# EasyEDA Pro project CH32V203_Wireless_Charge_V1.1.eprj, board CH32V203_Wireless_Charge
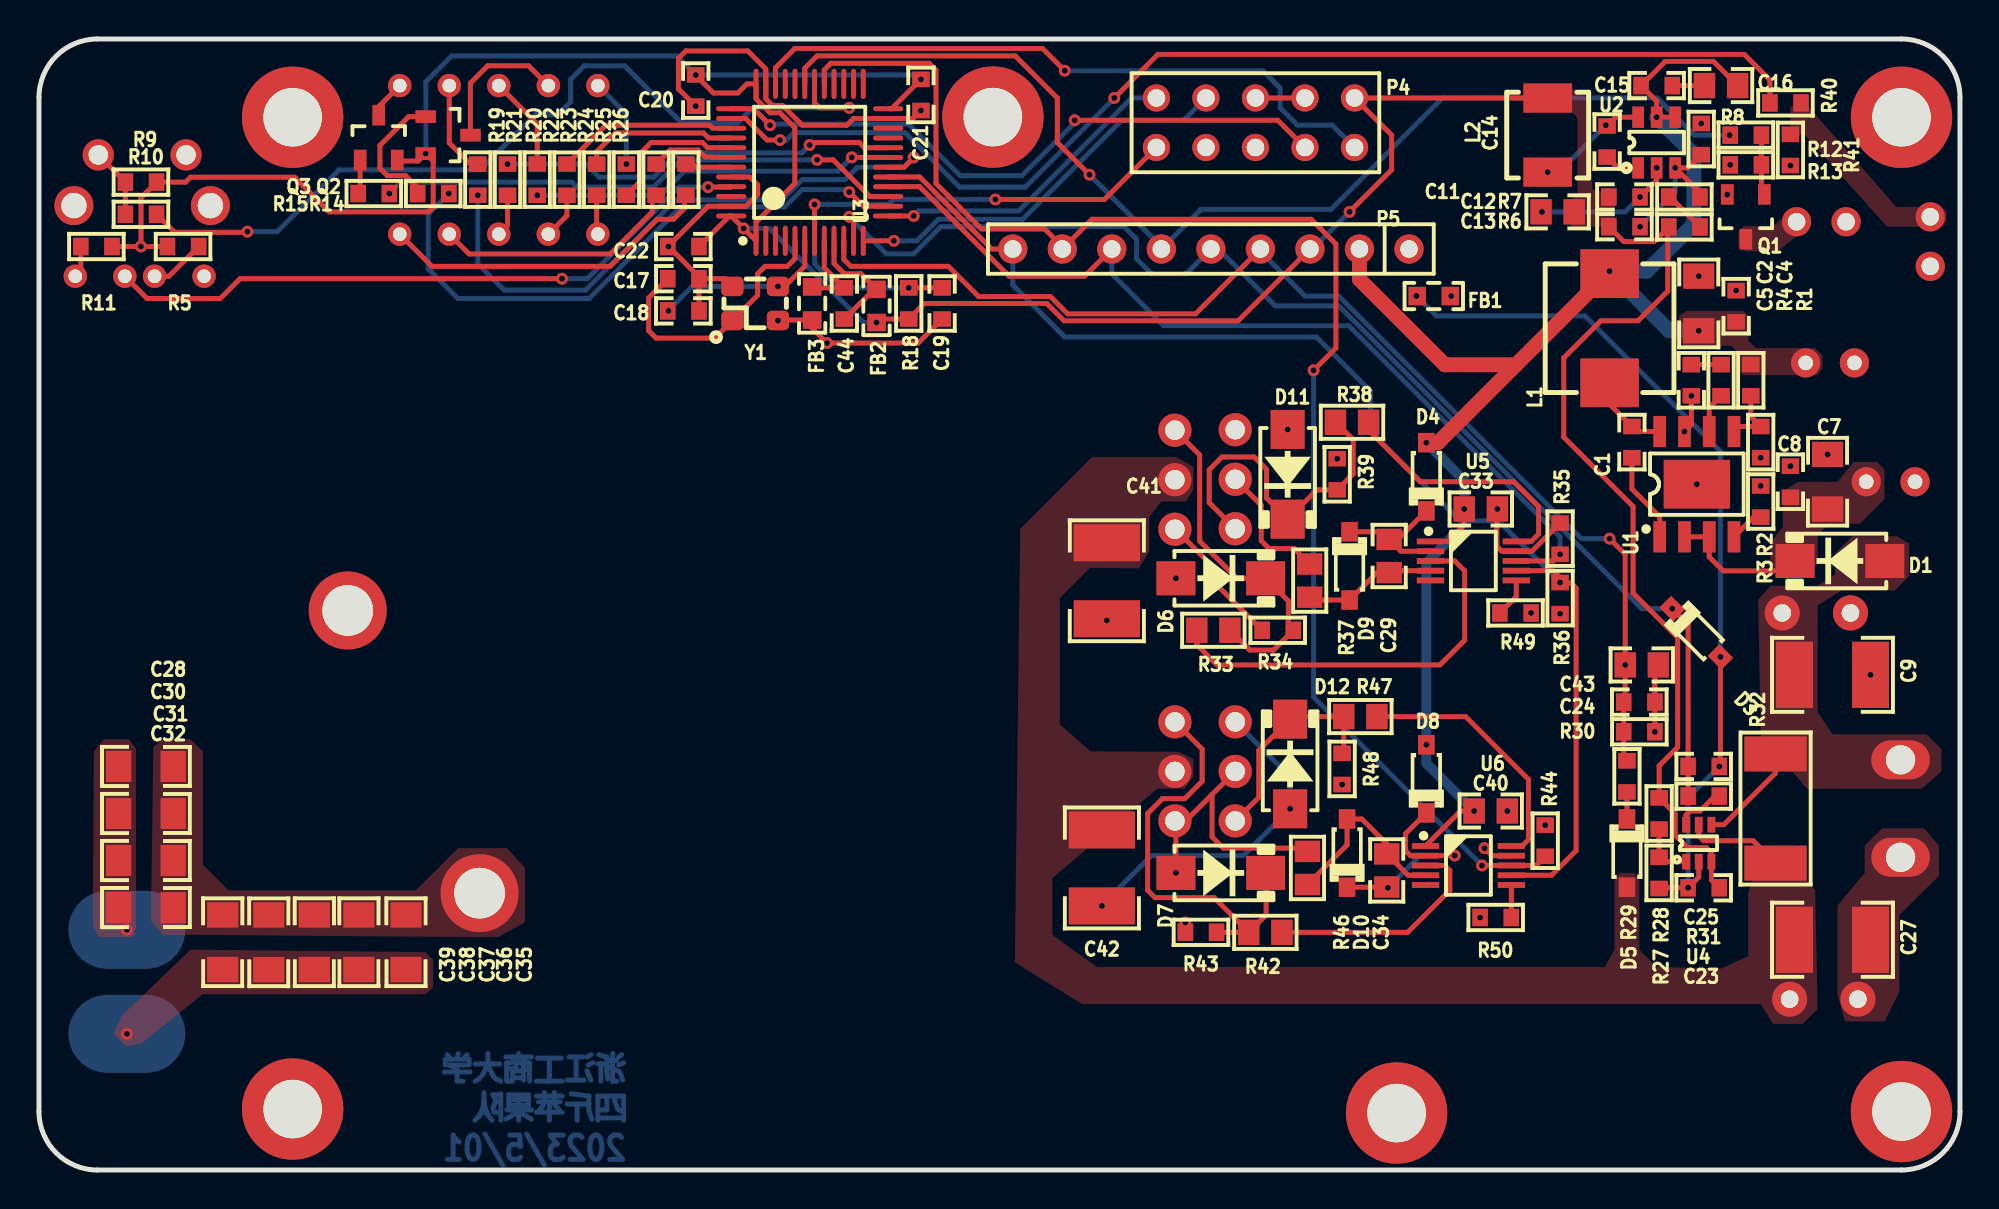
[diagram p1: board, top side]
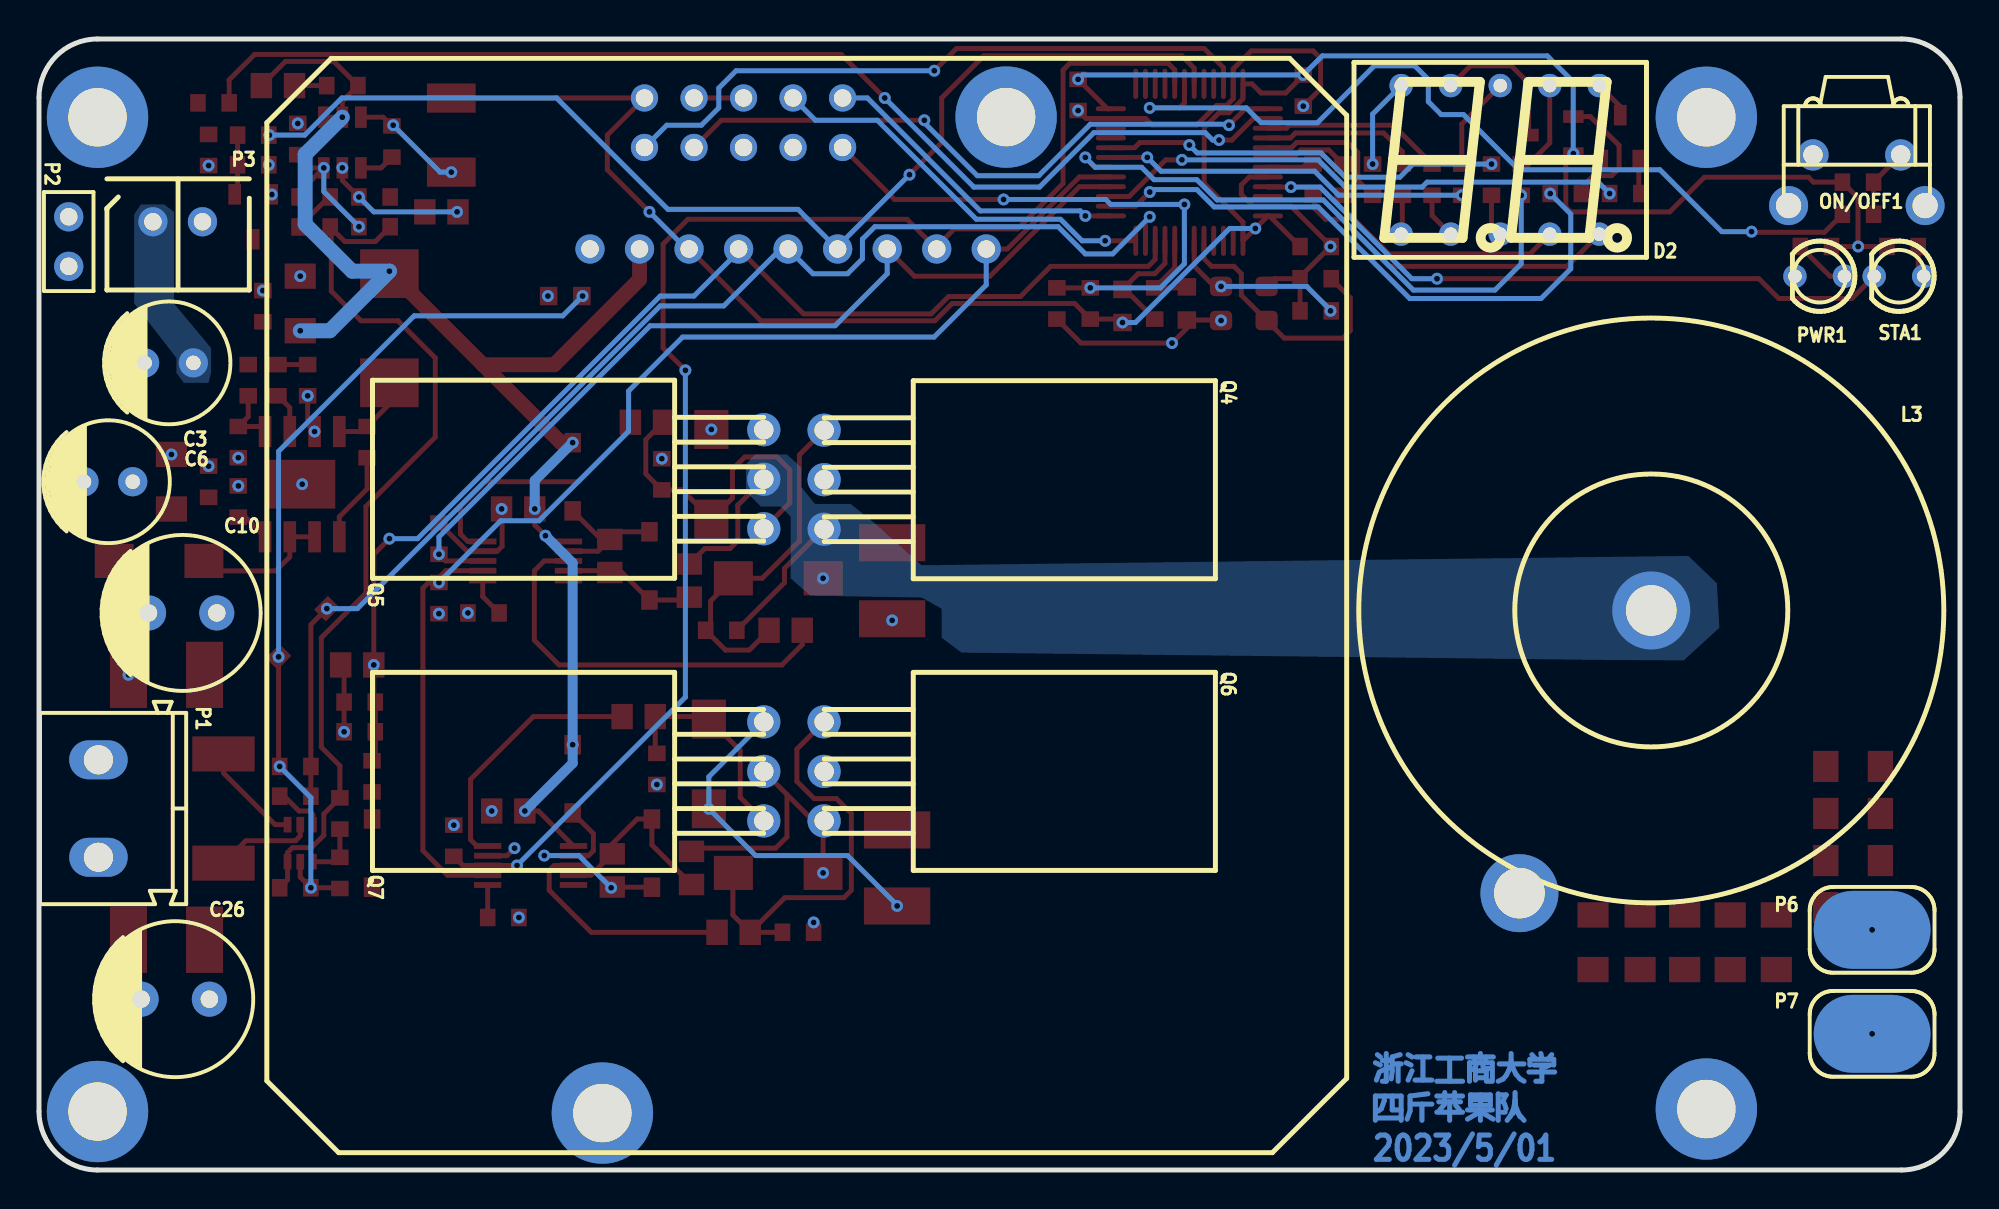
[diagram p2: board, bottom side, seen from below]

Outline 98.51 x 58.02 mm; copper layers: Top Layer, Bottom Layer. Coordinates in mm from the lower left corner of the outline.
Outline path: 0,55.02 0,3 arc(0.88,0.88) 3,0 95.51,0 arc(97.63,0.88) 98.51,3 98.51,55.02 arc(97.63,57.14) 95.51,58.02 3,58.02 arc(0.88,57.14) 0,55.02
Stack: Top Layer 0.0356mm / Dielectric 1 0.32mm FR-4 er 4.8 / Bottom Layer 0.0356mm

## Design rules (mm)
template: 用户自定义配置
spacing copperThickness1oz (default): track to track 0.102, other pairs 0.152 to 0.3
spacing copperThickness2oz: track to track 0.203, other pairs 0.152 to 0.3
track width copperThickness1oz (default): min 0.127, default 0.254, max 2.54
track width copperThickness2oz: min 0.203, default 0.254, max 2.54
differential pair differentialPair (default): width min 0.127, default 0.254, max 2.54; gap min 0.152, default 0.152
via viaSize (default): diameter min 0.5, default 0.61, max 10; hole min 0.3, default 0.305, max 6.299

## Placement (name value [footprint] x y rotation side)
C1  100nF  [CAPC1608[0603]S-N]  81.68 37.34 90 top
C2  47uF  [CAPC3216[1206]S]  85.11 44.45 270 top
C3  220uF  [Cap-S-D 2.5-6.3X8]  91.84 41.4 0 bottom
C4  100nF  [CAPC1608[0603]S-N]  87.03 44.31 270 top
C5  4.7nF  [CAPC1608[0603]S-N]  84.73 40.51 90 top
C6  100uF  [Cap-S-D 2.5-6.3X8]  94.95 35.31 0 bottom
C7  4.7uF  [CAPC3216[1206]S]  91.72 35.31 270 top
C8  100nF  [CAPC1608[0603]S-N]  89.81 35.31 270 top
C9  47uF  [CAPC4532[1812]S]  91.97 25.4 0 top
C10  470uF  [Cap-S-D 3.5-8x14]  91.14 28.58 0 bottom
C11  22uF  [CAPC2012[0805]S-N]  77.87 49.15 180 top
C12  100nF  [CAPC1608[0603]S-N]  81.3 49.91 0 top
C13  220pF  [CAPC1608[0603]S-N]  81.3 48.39 0 top
C14  100nF  [CAPC1608[0603]S-N]  80.41 52.76 90 top
C15  100nF  [CAPC1608[0603]S-N]  82.95 55.63 0 top
C16  22uF  [CAPC2012[0805]S-N]  86.26 55.63 180 top
C17  18pF  [CAPC1608[0603]S-N]  33.04 45.72 0 top
C18  18pF  [CAPC1608[0603]S-N]  33.04 44.07 0 top
C19  100nF  [CAPC1608[0603]S-N]  46.31 44.45 90 top
C20  100nF  [CAPC1608[0603]S-N]  33.68 55.37 90 top
C21  100nF  [CAPC1608[0603]S-N]  45.22 55.15 90 top
C22  100nF  [CAPC1608[0603]S-N]  33.04 47.37 0 top
C23  100nF  [CAPC1608[0603]S-N]  85.37 14.48 0 top
C24  100nF  [CAPC1608[0603]S-N]  82.06 24 0 top
C25  1uF  [CAPC1608[0603]S-N]  85.37 20.7 0 top
C26  470uF  [Cap-S-D 3.5-8x14]  91.52 8.76 0 bottom
C27  47uF  [CAPC4532[1812]S]  91.97 11.81 0 top
C28  10nF  [CAPC3216[1206]S]  5.48 20.7 180 top
C29  10uF  [CAPC2012[0805]S-N]  69.24 31.5 270 top
C30  10nF  [CAPC3216[1206]S]  5.48 18.29 180 top
C31  10nF  [CAPC3216[1206]S]  5.48 15.88 180 top
C32  10nF  [CAPC3216[1206]S]  5.48 13.46 180 top
C33  22uF  [CAPC2012[0805]S-N]  73.94 33.91 0 top
C34  10uF  [CAPC2012[0805]S-N]  69.11 15.37 270 top
C35  1nF  [CAPC3216[1206]S]  18.82 11.68 90 top
C36  1nF  [CAPC3216[1206]S]  16.41 11.68 90 top
C37  100nF  [CAPC3216[1206]S]  14.12 11.68 90 top
C38  100nF  [CAPC3216[1206]S]  11.78 11.68 90 top
C39  100nF  [CAPC3216[1206]S]  9.42 11.68 90 top
C40  22uF  [CAPC2012[0805]S-N]  74.44 18.42 180 top
C41  47uF  [CAPC4532[1812]S]  54.76 30.23 90 top
C42  47uF  [CAPC4532[1812]S]  54.51 15.49 90 top
C43  10uF  [CAPC2012[0805]S-N]  82.19 25.91 0 top
C44  100nF  [CAPC1608[0603]S-N]  41.3 44.45 90 top
D1  SS54  [SMA-L[DO-214AC]]  92.35 31.24 180 top
D2  2821BS  [2821AS/BS]  23.58 51.82 180 bottom
D3  SMF3.3A  [SOD-123-L]  84.99 27.56 135 top
D4  1N4148  [SOD-123-L]  71.14 35.56 270 top
D5  1N4148  [SOD-123-L]  81.43 16.26 90 top
D6  SS54  [SMA-L[DO-214AC]]  60.6 30.35 0 top
D7  SS54  [SMA-L[DO-214AC]]  60.6 15.24 0 top
D8  1N4148  [SOD-123-L]  71.14 20.07 270 top
D9  SMF12A  [SOD-123-L]  67.21 30.99 90 top
D10  SMF12A  [SOD-123-L]  67.08 16.26 270 top
D11  SS54  [SMA-L[DO-214AC]]  64.03 35.69 270 top
D12  SS54  [SMA-L[DO-214AC]]  64.16 20.83 90 top
FB1  0R  [INDC1608[0603]S]  71.52 44.83 180 top
FB2  0R  [INDC1608[0603]S]  42.95 44.32 90 top
FB3  0R  [INDC1608[0603]S]  39.65 44.45 270 top
L1  4.7uH  [0630 TPC 7*7*3]  80.54 43.18 90 top
L2  3.3uH  [0402 TPC 4*4*2]  77.37 53.09 270 top
L3  3.722uH  [T94/106-LAY]  15.83 28.7 295 bottom
M1  MountHole  [m3-mounthole-plated]  95.51 54 180 bottom
M2  MountHole  [m3-mounthole-plated]  13.01 54 180 bottom
M3  MountHole  [m3-mounthole-plated]  95.51 3 180 bottom
M4  MountHole  [m3-mounthole-plated]  13.01 3.13 180 bottom
M5  MountHole  [m3-mounthole-plated]  48.92 54.01 0 top
M6  MountHole  [m3-mounthole-plated]  69.62 2.92 0 top
ON/OFF1  Button  [KEY-2-DIP-6*6-S]  5.29 52.07 180 bottom
P1  KF/WJ/DG 30x connecter  [KF/WJ/DG 301-2p-5.0mm]  95.46 18.54 270 bottom
P2  Header-D-M 1x2P  [HDR1X2-M]  96.98 48.89 270 bottom
P3  XH2.54-2P  [XH2.54-2P-DV]  92.67 48.64 180 bottom
P4  SWD  [HDR2X5-M]  67.46 54.99 180 top
P5  Header-D-M 1x9P  [HDR1X9-M]  70.25 47.24 180 top
P6  WirePad  [WirePad-4x6]  4.51 12.32 180 bottom
P7  WirePad  [WirePad-4x6]  4.51 6.98 180 bottom
PWR1  LED 3R  [LED-R3-H5-SINGLE-R]  7.19 45.85 0 bottom
Q1  AO3400  [SOT-23]  87.53 48.89 270 top
Q2  S8550  [SOT-23]  20.98 53.09 0 top
Q3  S8550  [SOT-23]  17.42 52.96 90 top
Q4  HYG180N10LS1P  [TO-220-LAY]  58.25 37.95 270 bottom
Q5  HYG180N10LS1P  [TO-220-LAY]  61.34 32.89 90 bottom
Q6  HYG180N10LS1P  [TO-220-LAY]  58.25 22.99 270 bottom
Q7  HYG180N10LS1P  [TO-220-LAY]  61.34 17.91 90 bottom
R1  140K  [RESC1608[0603]S-N]  87.78 40.51 270 top
R2  10K  [RESC1608[0603]S-N]  88.29 37.34 270 top
R3  200K  [RESC1608[0603]S-N]  88.29 34.29 270 top
R4  20K  [RESC1608[0603]S-N]  86.26 40.51 270 top
R5  2.7K  [RESC1608[0603]S-N]  7.39 47.37 0 top
R6  30K  [RESC1608[0603]S-N]  84.38 48.38 0 top
R7  15K  [RESC1608[0603]S-N]  84.38 49.91 180 top
R8  10K  [RESC1608[0603]S-N]  85.24 52.88 90 top
R9  10K  [RESC1608[0603]S-N]  5.23 50.67 180 top
R10  100R  [RESC1608[0603]S-N]  5.23 49.02 180 top
R11  2.7K  [RESC1608[0603]S-N]  2.94 47.37 180 top
R12  100R  [RESC1608[0603]S-N]  87.53 53.09 0 top
R13  10K  [RESC1608[0603]S-N]  87.53 51.56 180 top
R14  100R  [RESC1608[0603]S-N]  20.22 50.09 0 top
R15  100R  [RESC1608[0603]S-N]  17.17 50.09 0 top
R18  10K  [RESC1608[0603]S-N]  44.6 44.45 90 top
R19  1K  [RESC1608[0603]S-N]  22.5 50.8 90 top
R20  1K  [RESC1608[0603]S-N]  25.55 50.8 90 top
R21  1K  [RESC1608[0603]S-N]  24.03 50.8 270 top
R22  1K  [RESC1608[0603]S-N]  27.07 50.8 270 top
R23  1K  [RESC1608[0603]S-N]  28.6 50.8 270 top
R24  1K  [RESC1608[0603]S-N]  30.12 50.8 90 top
R25  1K  [RESC1608[0603]S-N]  31.65 50.8 270 top
R26  1K  [RESC1608[0603]S-N]  33.17 50.8 270 top
R27  0R  [RESC1608[0603]S-N]  83.08 15.24 270 top
R28  0R(NC)  [RESC1608[0603]S-N]  83.08 18.29 90 top
R29  5.1K  [RESC1608[0603]S-N]  81.43 20.19 90 top
R30  510R  [RESC1608[0603]S-N]  82.06 22.48 0 top
R31  1K  [RESC1608[0603]S-N]  85.37 19.18 180 top
R32  2mR  [RESC6332[2512]S]  89.05 18.54 270 top
R33  10R  [RESC2012[0805]S-N]  60.22 27.69 0 top
R34  10K  [RESC1608[0603]S-N]  63.52 27.69 180 top
R35  10K  [RESC1608[0603]S-N]  78 32.39 90 top
R36  10K  [RESC1608[0603]S-N]  78 29.34 270 top
R37  2.2R  [RESC2012[0805]S-N]  65.16 30.23 90 top
R38  10R  [RESC2012[0805]S-N]  67.33 38.35 180 top
R39  10K  [RESC1608[0603]S-N]  66.57 35.69 90 top
R40  100R  [RESC1608[0603]S-N]  89.56 54.74 0 top
R41  10K  [RESC1608[0603]S-N]  89.81 52.32 90 top
R42  10R  [RESC2012[0805]S-N]  62.89 12.19 0 top
R43  10K  [RESC1608[0603]S-N]  59.59 12.19 0 top
R44  10K  [RESC1608[0603]S-N]  77.24 16.89 270 top
R46  2.2R  [RESC2012[0805]S-N]  65.05 15.49 270 top
R47  10R  [RESC2012[0805]S-N]  67.76 23.26 0 top
R48  10K  [RESC1608[0603]S-N]  66.82 20.57 90 top
R49  10K  [RESC1608[0603]S-N]  75.71 28.58 0 top
R50  10K  [RESC1608[0603]S-N]  74.7 12.95 0 top
STA1  LED  [LED-R3-H5-SINGLE-B]  1.86 45.85 0 bottom
U1  SP1N28STER  [SOP-8E]  85.01 35.18 90 top
U2  RY8121  [SOT-23-6]  82.95 52.7 90 top
U3  CH32V203CxT6  [LQFP48_L]  39.52 51.69 90 top
U4  TP181A1  [SOT-363]  85.11 16.76 90 top
U5  DGD0506A  [MSOP-10]  73.56 31.24 0 top
U6  DGD0506A  [MSOP-10]  73.3 15.62 0 top
Y1  8MHz  [X3225-4]  36.73 44.45 0 top

## Footprints (pads in the part's own frame, mm; a bottom-side part is the same pattern mirrored in y, then rotated)
0402 TPC 4*4*2
  rect 1.5x2.5 smd: 1(-1.9,0) 2(1.9,0)
0630 TPC 7*7*3
  rect 2.5x3 smd: 1(-2.8,0) 2(2.8,0)
2821AS/BS
  round 1.2 hole 0.7: 1(-5.08,-3.81) 2(-2.54,-3.81) 3(0,-3.81) 4(2.54,-3.81) 5(5.08,-3.81) 6(5.08,3.81) 7(2.54,3.81) 8(0,3.81) 9(-2.54,3.81) 10(-5.08,3.81)
Cap-S-D 2.5-6.3X8
  rrect 1.5x1.5 hole 0.75: 1(-1.25,0)
  round 1.5 hole 0.75: 2(1.25,0)
Cap-S-D 3.5-8x14
  rrect 1.8x1.8 hole 0.9: 1(-1.75,0)
  round 1.8 hole 0.9: 2(1.75,0)
CAPC1608[0603]S-N
  rect 0.8x0.9 smd: 1(-0.8,0) 2(0.8,0)
CAPC2012[0805]S-N
  rect 1.1x1.3 smd: 1(-0.85,0) 2(0.85,0)
CAPC3216[1206]S
  rect 1.3x1.6 smd: 1(-1.4,0) 2(1.4,0)
CAPC4532[1812]S
  rect 1.9x3.4 smd: 1(-1.95,0) 2(1.95,0)
HDR1X2-M
  round 1.5 hole 0.9: 1(0,0) 2(2.54,0)
HDR1X9-M
  round 1.5 hole 0.9: 1(0,0) 2(2.54,0) 3(5.08,0) 4(7.62,0) 5(10.16,0) 6(12.7,0) 7(15.24,0) 8(17.78,0) 9(20.32,0)
HDR2X5-M
  round 1.397 hole 0.9: 1(0,0) 2(0,2.54) 3(2.54,0) 4(2.54,2.54) 5(5.08,0) 6(5.08,2.54) 7(7.62,0) 8(7.62,2.54) 9(10.16,0) 10(10.16,2.54)
INDC1608[0603]S
  rect 0.9x0.95 smd: 1(-0.85,0) 2(0.85,0)
KEY-2-DIP-6*6-S
  round 2 hole 1.3: 0(-3.5,-2.6) 0(3.5,-2.6)
  round 1.6 hole 1: 1(-2.25,0) 2(2.25,0)
KF/WJ/DG 301-2p-5.0mm
  oval 2x3 hole 1.5: 1(2.5,0) 2(-2.5,0)
LED-R3-H5-SINGLE-B
  round 1.2 hole 0.7: 1(0,0) 2(2.54,0)
LED-R3-H5-SINGLE-R
  round 1.2 hole 0.7: 1(-1.27,0) 2(1.27,0)
LQFP48_L
  oval 1.55x0.254 smd: 1(-4.025,2.75) 2(-4.025,2.25) 3(-4.025,1.75) 4(-4.025,1.25) 5(-4.025,0.75) 6(-4.025,0.25) 7(-4.025,-0.25) 8(-4.025,-0.75) 9(-4.025,-1.25) 10(-4.025,-1.75) 11(-4.025,-2.25) 12(-4.025,-2.75) 25(4.025,-2.75) 26(4.025,-2.25) 27(4.025,-1.75) 28(4.025,-1.25) 29(4.025,-0.75) 30(4.025,-0.25) 31(4.025,0.25) 32(4.025,0.75) 33(4.025,1.25) 34(4.025,1.75) 35(4.025,2.25) 36(4.025,2.75)
  oval 0.254x1.55 smd: 13(-2.75,-4.025) 14(-2.25,-4.025) 15(-1.75,-4.025) 16(-1.25,-4.025) 17(-0.75,-4.025) 18(-0.25,-4.025) 19(0.25,-4.025) 20(0.75,-4.025) 21(1.25,-4.025) 22(1.75,-4.025) 23(2.25,-4.025) 24(2.75,-4.025) 37(2.75,4.025) 38(2.25,4.025) 39(1.75,4.025) 40(1.25,4.025) 41(0.75,4.025) 42(0.25,4.025) 43(-0.25,4.025) 44(-0.75,4.025) 45(-1.25,4.025) 46(-1.75,4.025) 47(-2.25,4.025) 48(-2.75,4.025)
m3-mounthole-plated
  round 5.2 hole 3: 1(0,0)
MSOP-10
  rect 1.4x0.3 smd: 1(-2.2,1) 2(-2.2,0.5) 3(-2.2,0) 4(-2.2,-0.5) 5(-2.2,-1) 6(2.2,-1) 7(2.2,-0.5) 8(2.2,0) 9(2.2,0.5) 10(2.2,1)
RESC1608[0603]S-N
  rect 0.8x0.9 smd: 1(-0.8,0) 2(0.8,0)
RESC2012[0805]S-N
  rect 1.1x1.3 smd: 1(-0.85,0) 2(0.85,0)
RESC6332[2512]S
  rect 1.8x3.2 smd: 1(-2.8,0) 2(2.8,0)
SMA-L[DO-214AC]
  rect 2x1.75 smd: A(-2.3,0) K(2.3,0)
SOD-123-L
  rect 1x0.85 smd: A(-1.75,0) K(1.75,0)
SOP-8E
  rect 2.5x3.4 smd: 0(0,0)
  rect 1.6x0.65 smd: 1(-2.7,1.905) 2(-2.7,0.635) 3(-2.7,-0.635) 4(-2.7,-1.905) 5(2.7,-1.905) 6(2.7,-0.635) 7(2.7,0.635) 8(2.7,1.905)
SOT-23
  rect 1.05x0.65 smd: 1(-1.15,0.95) 2(-1.15,-0.95) 3(1.15,0)
SOT-23-6
  rect 1.1x0.6 smd: 1(-1.3,0.95) 2(-1.3,0) 3(-1.3,-0.95) 4(1.3,-0.95) 5(1.3,0) 6(1.3,0.95)
SOT-363
  rect 0.8x0.4 smd: 1(-0.95,0.65) 2(-0.95,0) 3(-0.95,-0.65) 4(0.95,-0.65) 5(0.95,0) 6(0.95,0.65)
T94/106-LAY
  round 4 hole 2.6: 1(0,0) 2(16,0)
TO-220-LAY
  round 1.7 hole 1: 1(0,0) 2(2.54,0) 3(5.08,0)
WirePad-4x6
  rrect 6x4 smd: 1(0,0)
X3225-4
  rrect 1.143x1 smd: 1(-1.169,-0.874) 2(1.169,-0.874) 3(1.169,0.874) 4(-1.169,0.874)
XH2.54-2P-DV
  rrect 1.5x1.5 hole 0.9: 1(0,0)
  round 1.5 hole 0.9: 2(2.54,0)

## Nets
As in the schematic.

Pads without a net: M1 1; M2 1; M3 1; M4 1; M5 1; M6 1; ON/OFF1 0; P4 6 8; U3 2 3 4 21 22 25 26 27 28 32 33 46; U5 5; U6 5

## Via types
v1: diameter 0.61, hole 0.305, Top Layer to Bottom Layer, 104 vias

## Routing (per net, layer and track width the routed paths; a pad name or vN(x,y) marks a point on that pad's centre or on a via; arc(x,y) is an arc through that point)
GND: length 39
  Top Layer w0.254: v1(82.1,49.91) 82.95,50.76 v1(82.95,51.41) ; 83.04,25.78 82.86,25.6 v1(82.86,22.48) ; v1(74.79,33.91) 74.76,33.88 74.76,31.99 75.01,31.74 U5.9 76.56,31.74 R35.2 ; v1(74.12,16.51) 74.51,16.12 U6.9 ; v1(84.38,37.88) 84.73,38.23 v1(84.73,39.71) ; C15.2 C16.2
  Bottom Layer w0.254: v1(77.07,49.15) 81.34,49.15 v1(82.1,49.91) ; v1(54.51,13.54) 54.51,13.59 57.05,16.13 61.76,16.13 v1(64.16,18.53) 64.16,20.17 Q7.3
  vias: v1(54.76,28.19) v1(64.03,37.99) v1(66.57,36.49) v1(66.82,19.77) v1(72.41,44.83) v1(73.9,12.95) v1(75.29,18.42) v1(76.51,28.58) v1(77.24,17.69) v1(78,28.54) v1(85.01,35.18) v1(85.11,45.85) v1(85.24,53.68) v1(86.57,50.04) v1(86.73,51.56) v1(87.03,45.11) v1(88.29,36.54) v1(88.29,35.09) v1(89.81,51.52) v1(89.81,36.11) v1(91.72,36.71) v1(93.92,25.4)
GNDMCU: length 89
  Top Layer w0.254: C17.2 35.16,45.72 Y1.4 ; C17.2 33.84,45.81 v1(32.28,47.37) ; C17.2 C18.2 ; C19.1 45.08,42.42 v1(40.41,42.42) 39.65,43.18 FB3.2 37.92,43.6 v1(37.89,43.58) ; U4.2 85.11,15.02 v1(84.57,14.48) 83.12,14.48 R27.2 ; P4.3 P4.5 ; 32.24,47.37 34.31,49.44 U3.47 36.25,49.44 36.85,50.04 36.85,50.53 36.45,50.94 U3.44 ; v1(86.22,26.32) 86.22,20.76 v1(86.17,20.7) ; v1(33.68,54.57) 32.79,55.46 32.79,57.02 33.17,57.4 36.34,57.4 37.27,56.48 U3.35 37.27,54.95 37.61,54.61 38.12,54.61 39.14,53.59 41.42,53.59 41.77,53.94 U3.23 44.82,53.94 v1(45.22,54.35)
  Bottom Layer w0.254: v1(84.57,14.48) 84.57,19.1 v1(86.17,20.7) ; v1(86.22,26.32) 86.22,36.86 79.27,43.81 71.65,43.81 v1(70.63,44.83)
VBAT: length 5.4
  Top Layer w0.254: R32.1 89.05,20.37 86.4,17.71 U4.4
VBATO: length 5.1
  Top Layer w0.254: U4.5 85.11,17.14 85.36,16.89 87.9,16.89 R32.2
VCC3V3: length 175.5
  Top Layer w0.254: C13.1 81.26,47.62 82.83,47.62 83.52,48.32 ; L2.1 77.36,54.99 P4.1 69.36,53.09 69.36,51.31 v1(67.21,49.15) ; C22.2 35.41,48.94 U3.48 v1(36.14,48.3) U3.1 36.77,48.62 38.76,50.61 38.76,53.47 38,54.23 37.49,54.23 36.77,54.95 U3.36 36.31,55.71 35.84,55.25 34.58,55.25 33.68,56.15 v1(33.68,56.17) ; C23.2 85.76,14.88 U4.3 85.76,16.28 85.51,16.54 84.54,16.54 83.9,17.17 83.9,18.27 R28.2 83.08,20.74 84.03,21.69 84.03,27.31 81.74,29.59 81.74,34.04 78.19,37.59 78.19,41.66 80.09,43.56 82,43.56 83.52,45.08 83.52,48.32 ; R6.1 83.52,48.32 ; Q3.2 18.43,51.75 19.45,51.75 v1(19.83,52.14) 20.22,51.75 20.22,49.4 19.96,49.15 14.88,49.15 13.1,50.93 7.77,50.93 7.52,50.67 R9.1 5.23,49.87 5.23,47.38 v1(5.22,47.37) ; v1(45.22,55.95) 43.72,54.44 U3.24 ; R11.1 v1(5.22,47.37) ; v1(5.22,47.37) R5.1 ; v1(42.95,43.47) 43.13,43.65 R18.1 45.4,44.45 51.68,44.45 52.57,43.56 61.49,43.56 P5.3
  Bottom Layer w0.254: v1(42.95,43.47) 42.28,43.47 37.46,48.3 v1(36.14,48.3) ; v1(19.83,52.14) 19.83,52.14 19.83,55.82 21.17,57.15 32.7,57.15 v1(33.68,56.17) 45,56.17 v1(45.22,55.95) ; P5.3 65.3,47.24 v1(67.21,49.15)
VCC12V: length 76.8
  Top Layer w0.254: U6.1 72.9,18.42 v1(73.59,18.42) ; C16.1 85.86,56.87 83.4,56.87 C15.1 82.95,54.83 v1(82.95,54) U2.4 ; U5.1 72.24,32.24 v1(72.54,32.54) 73.09,33.08 v1(73.09,33.91)
  Top Layer w0.762: v1(71.14,37.31) 71.74,37.31 75.74,41.31 ; 75.74,41.31 72.09,41.31 67.71,45.68 P5.2 ; 75.74,41.31 v1(80.54,46.11)
  Bottom Layer w0.508: v1(73.09,33.91) 73.09,35.37 v1(71.14,37.31) ; v1(73.59,18.42) 71.14,20.87 v1(71.14,21.82) 71.14,31.14 v1(72.54,32.54)
  Bottom Layer w0.762: v1(82.95,54) 84.86,52.1 84.86,48.51 82.45,46.11 v1(80.54,46.11) 83.6,43.05 v1(85.11,43.05)
(no net): length 2.2
  Top Layer w0.254: M5.1 46.72,54.01
DBGRX: length 16.3
  Top Layer w0.254: v1(44.85,48.94) U3.13
  Bottom Layer w0.254: P4.9 56.03,54.99 50.24,49.2 45.11,49.2 v1(44.85,48.94)
DBGTX: length 20.6
  Top Layer w0.254: U3.12 v1(43.84,47.66)
  Bottom Layer w0.254: P4.7 58.7,53.85 55.52,53.85 50.44,48.77 46.12,48.77 45.02,47.66 v1(43.84,47.66)
DIG1: length 31.2
  Top Layer w0.254: v1(41.55,50.17) 42.28,49.44 U3.14
  Bottom Layer w0.254: v1(21.02,50.09) 19.96,49.03 19.96,46.23 21.49,44.7 28.22,44.7 32.92,49.4 38.24,49.4 39.13,50.29 41.42,50.29 v1(41.55,50.17)
DIG2: length 27.3
  Top Layer w0.254: U3.15 42.6,49.94 40.73,51.82 v1(39.9,51.82)
  Bottom Layer w0.254: v1(39.9,51.82) 32.92,51.82 31.52,50.42 27.58,50.42 27.33,50.67 18.55,50.67 v1(17.97,50.09)
DIGA: length 30.8
  Top Layer w0.254: v1(44.85,51.94) 44.85,51.92 44.37,51.44 U3.18
  Bottom Layer w0.254: v1(22.5,50) 22.5,46.48 23.85,45.14 28.03,45.14 32.65,49.76 38.1,49.76 39.14,50.8 41.33,50.8 41.97,51.44 44.35,51.44 v1(44.85,51.94)
DIGB: length 18.8
  Top Layer w0.254: U3.19 43.54,51.94 v1(41.68,51.94)
  Bottom Layer w0.254: v1(41.68,51.94) 40.97,51.23 33.09,51.23 31.86,50 v1(25.55,50)
DIGC: length 20.6
  Top Layer w0.254: U3.20 42.33,52.44 42.06,52.7 39.65,52.7 v1(39.52,52.58)
  Bottom Layer w0.254: v1(39.52,52.58) 39.11,52.17 32.77,52.17 31.52,50.93 28.72,50.93 28.05,51.6 v1(24.03,51.6)
DIGD: length 9.3
  Top Layer w0.254: R22.1 29.07,53.59 34.39,53.59 34.54,53.44 U3.39
DIGDP: length 2.4
  Top Layer w0.254: U3.43 33.69,51.44 33.53,51.6 R26.1
DIGE: length 8
  Top Layer w0.254: U3.40 34.33,52.94 34.08,53.19 29.56,53.19 28.6,52.23 R23.1
DIGF: length 7.4
  Top Layer w0.254: U3.41 34.29,52.44 34.02,52.7 31.39,52.7 30.88,52.2 30.88,50.76 R24.1
DIGG: length 4.3
  Top Layer w0.254: U3.42 34.54,51.94 34.53,51.96 34.17,51.96 33.8,52.32 32.37,52.32 R25.1
EN: length 59.6
  Top Layer w0.254: v1(55.14,54.99) 57.38,57.23 87.45,57.23 88.76,55.92 R40.1 ; v1(38,52.83) 37.34,52.83 36.23,53.94 U3.38
  Bottom Layer w0.254: v1(38,52.83) 38.33,52.83 38.71,53.21 44.41,53.21 47.2,50.42 50.57,50.42 v1(55.14,54.99)
FAN: length 58
  Top Layer w0.254: v1(86.7,53.09) R12.1 ; U3.31 39.27,56.52 39.9,57.15 50.06,57.15 52.22,54.99 52.22,52.7 v1(53.87,51.05)
  Bottom Layer w0.254: v1(86.7,53.09) 84.88,53.09 82.98,54.99 71.97,54.99 66.25,49.28 59.59,49.28 P5.6 57.55,47.37 v1(53.87,51.05)
LCCA: length 13.7
  Top Layer w0.254: R34.2 60.28,30.13 60.28,30.86 58.27,32.87 Q4.3 ; R37.2 64.37,31.88 63.07,31.88 62.68,32.28 62.68,34.1 Q5.2
  vias: v1(58.3,30.35)
LCCB: length 14.2
  Top Layer w0.254: 60.15,19.26 Q7.2 ; 60.15,19.26 58.8,17.91 Q6.3 58.3,17.85 v1(58.3,15.24) ; 60.15,19.26 60.15,17.08 60.73,16.51 64.88,16.51 R46.1
  vias: v1(4.51,6.98) v1(58.79,12.7)
LED: length 33.9
  Top Layer w0.254: U3.45 35.47,50.42 v1(34.31,50.42) ; STA1.2 5.54,44.7 9.29,44.7 10.31,45.72 v1(26.82,45.72)
  Bottom Layer w0.254: v1(26.82,45.72) 28.11,45.72 32.81,50.42 v1(34.31,50.42)
MOD: length 44.5
  Top Layer w0.254: R10.1 6.95,48.1 10.66,48.1 v1(10.69,48.13) ; U3.30 39.77,54.74 40.03,54.48 v1(41.55,54.48)
  Bottom Layer w0.254: v1(41.55,54.48) 36.6,54.48 35.84,53.72 32.95,53.72 30.03,56.64 27.96,56.64 27.26,55.94 27.26,54.8 26.6,54.14 25.46,54.14 22.63,51.31 15.39,51.31 12.21,48.13 v1(10.69,48.13)
PC: length 64.8
  Top Layer w0.254: U3.11 41.77,48.68 v1(41.55,48.89) ; v1(83.75,28.8) 84.57,27.98 C25.1 R31.2
  Bottom Layer w0.254: v1(41.55,48.89) 43.46,46.99 44.85,46.99 46.25,48.39 55.65,48.39 56.28,47.75 56.28,46.74 57.05,45.97 58.82,45.97 P5.5 ; 60.09,47.62 63.4,44.32 66.65,44.32 82.18,28.8 v1(83.75,28.8)
PV: length 60.8
  Top Layer w0.254: R29.2 81.26,21.16 R30.1 C24.1 81.34,24.08 v1(81.34,25.91) 81.34,31.58 v1(80.54,32.39) ; P5.4 59.31,43.92 52.75,43.92 51.86,44.81 48.18,44.81 46.63,46.36 41.63,46.36 41.27,46.71 U3.10
  Bottom Layer w0.254: v1(80.54,32.39) 79.1,32.39 66.65,44.83 64.92,44.83 62.63,47.12 P5.4
PWMEN: length 66.3
  Top Layer w0.254: U3.17 45.16,50.94 48.85,47.24 P5.9 ; U6.7 77.56,15.12 78.82,16.38 78.82,29.84 78.57,30.1 78.04,30.1 v1(78,30.14) 78,30.39 77.65,30.74 U5.7
  Bottom Layer w0.254: P5.9 49.93,45.4 52.61,42.73 65.51,42.73 68.27,39.96 68.27,37.89 72.87,33.3 74.83,33.3 v1(78,30.14)
PWMINA: length 47.1
  Top Layer w0.254: P5.7 53.62,45.85 49.75,45.85 45.16,50.44 U3.16 ; U5.8 77.66,31.24 v1(78,31.58)
  Bottom Layer w0.254: v1(78,31.58) 78,32.47 67.17,43.31 57.68,43.31 55.01,45.97 P5.7
PWMINB: length 75
  Top Layer w0.254: R44.2 76.77,15.62 U6.8 v1(74,15.62) ; v1(65.36,41.02) 66.5,42.16 66.5,47.5 65.23,48.77 54,48.77 P5.8 52.47,47.37 51.57,48.27 48.33,48.27 46,50.6 46,56.42 45.65,56.77 40.6,56.77 40.27,56.44 U3.29
  Bottom Layer w0.254: v1(65.36,41.02) 65.36,24.26 v1(74,15.62)
RST: length 30.7
  Top Layer w0.254: U3.7 39.77,47.67 v1(39.77,49.53) ; C19.2 v1(44.6,45.25) ; v1(49.04,49.78) 54.63,49.78 P4.10
  Bottom Layer w0.254: v1(49.04,49.78) 43.81,49.78 43.55,49.53 v1(39.77,49.53) 39.77,46.48 41.01,45.25 v1(44.6,45.25)
SWCLK: length 32.7
  Top Layer w0.254: P4.4 63.52,53.85 v1(53.11,53.85) ; v1(37.49,53.59) 36.64,54.44 U3.37
  Bottom Layer w0.254: v1(37.49,53.59) 37.54,53.64 44.6,53.64 47.24,51 50.39,51 53.11,53.72 v1(53.11,53.85)
SWDIO: length 33.6
  Top Layer w0.254: U3.34 37.77,56.54 38.76,57.53 51.46,57.53 v1(52.6,56.39)
  Bottom Layer w0.254: P4.2 66.32,53.59 64.54,53.59 63.65,54.48 63.65,55.5 62.76,56.39 v1(52.6,56.39)
$1N4612: length 3.6
  Top Layer w0.254: R10.2 R9.2 4.43,50.68 ON/OFF1.2
$1N4807: length 1.6
  Top Layer w0.254: STA1.1 2.14,46.13 R11.2
$1N5719: length 9.3
  Top Layer w0.254: v1(37.89,45.32) 38.23,45.32 39.27,46.36 U3.6
  Bottom Layer w0.254: v1(37.89,45.32) 33.5,45.32 32.28,44.11 v1(32.28,44.07)
$1N5749: length 14
  Top Layer w0.254: 32.24,45.72 31.26,44.74 31.26,43.05 31.65,42.67 34.65,42.67 Y1.1 36.85,44.87 36.85,45.97 37.23,46.36 38.38,46.36 38.77,46.75 U3.5
$1N6321: length 6.2
  Top Layer w0.254: C44.1 42.82,45.17 FB2.2 42.15,45.97 41.3,45.97 40.77,46.5 U3.9
$1N6859: length 4.5
  Top Layer w0.254: U3.8 40.27,46.28 C44.2 39.7,45.25 FB3.1
$1N7370: length 3.1
  Top Layer w0.254: Q1.1 88.33,50.19 R13.1 R12.2
$1N7542: length 7.5
  Top Layer w0.254: Q2.3 22.12,53.09 22.12,55.75 23.01,56.64 25.1,56.64 D2.9
$1N7545: length 2
  Top Layer w0.254: 17.42,54.11 17.42,54.55 D2.6
$1N7548: length 6.8
  Top Layer w0.254: R14.1 19.42,50.39 18.8,51 17.86,51 17.48,51.39 17.48,52.56 18.96,54.04 Q2.1
$1N7551: length 1.8
  Top Layer w0.254: Q3.1 16.47,50.19 R15.1
$1N7793: length 4.9
  Top Layer w0.254: R19.2 22.12,51.6 21.04,52.68 D2.7
$1N7897: length 4.8
  Top Layer w0.254: R20.2 25.55,53.65 D2.8
$1N7950: length 2.2
  Top Layer w0.254: R21.2 24.03,48.45 D2.3
$1N8003: length 2.4
  Top Layer w0.254: D2.2 27.07,48.96 R22.2
$1N8056: length 2
  Top Layer w0.254: D2.1 28.6,48.07 R23.2
$1N8109: length 4.6
  Bottom Layer w0.254: v1(30.12,51.6) 30.12,54.16 D2.10
$1N8162: length 12.7
  Top Layer w0.254: D2.4 22.05,46.99 29.29,46.99 31.45,49.15 31.45,49.81 R25.2
$1N8215: length 17.2
  Top Layer w0.254: D2.5 20.15,46.36 29.29,46.36 31.71,48.77 32.53,48.77 33.1,49.34 33.1,49.93 R26.2
$1N8723: length 1.8
  Top Layer w0.254: U1.4 87.93,33.49 R3.2
$1N9081: length 7.2
  Top Layer w0.254: D1.K 89.54,30.73 86.37,30.73 85.65,31.45 U1.3 U1.2
$1N9175: length 4.6
  Top Layer w0.254: C1.1 81.68,34.93 83.11,33.51 U1.1
$1N9376: length 4.2
  Top Layer w0.254: L1.1 80.54,39.28 C1.2 81.94,37.88 U1.8
$1N9677: length 2.1
  Top Layer w0.254: U1.6 85.65,39.11 86.26,39.71
$1N9680: length 1.5
  Top Layer w0.254: R4.1 C5.2
$1N9816: length 3.3
  Top Layer w0.254: 87.78,39.71 87.78,38.65 R2.1 87.18,38.14 U1.5
$1N9982: length 1.8
  Top Layer w0.254: C14.1 80.96,51.41 U2.1
$1N10863: length 2.9
  Top Layer w0.254: PWR1.1 6.66,45.85 R5.2
$1N10932: length 5.8
  Top Layer w0.254: C14.2 80.86,54 U2.6
  Bottom Layer w0.254: v1(80.35,53.59) 77.94,51.19 v1(77.37,51.19)
$1N24970:
  vias: v1(4.51,12.32)
$1N25510: length 2.9
  Top Layer w0.254: U4.1 83.31,15.81 R27.1 R28.1
$1N25604: length 2.6
  Top Layer w0.254: R31.1 85.94,19.18 85.17,18.42 84.66,18.42 84.46,18.22 U4.6
$1N26177: length 1.4
  Top Layer w0.254: D5.K R29.1
$1N26803: length 7.1
  Top Layer w0.254: C29.1 68.85,32.74 D9.K ; C29.1 69.84,31.74 U5.2 ; C29.1 69.68,32.35 D4.K
$1N26913: length 2
  Top Layer w0.254: U5.6 75.76,29.42 74.91,28.58
$1N27170: length 13.4
  Top Layer w0.254: U5.10 76.52,32.24 76.9,32.62 76.9,34.02 75.61,35.31 70.83,35.31 68.18,37.95 R38.1
$1N27277: length 7.1
  Top Layer w0.254: 68.97,30.65 C29.2 ; 68.97,30.65 68.61,30.65 D9.A 65.31,29.24 R37.1 ; 68.97,30.65 69.06,30.74 U5.4
$1N27393: length 21
  Top Layer w0.254: R33.1 59.37,26.95 60.41,25.91 71.84,25.91 73.11,27.18 73.11,30.73 72.6,31.24 U5.3
$1N27694: length 17.4
  Top Layer w0.254: Q5.1 60.01,34.23 60.01,35.92 60.66,36.58 62.31,36.58 62.95,35.94 62.95,34.47 D11.K 65.53,34.89 R39.1 67.39,35.71 67.39,37.47 66.5,38.35 R38.2
$1N27962: length 17.7
  Top Layer w0.254: Q4.1 59.52,36.68 59.52,32.26 61.42,30.35 D6.K 64.07,29.19 64.07,27.94 R34.1 63.31,26.67 62.09,26.67 61.07,27.69
$1N28438: length 22.2
  Top Layer w0.254: R43.2 R42.1 ; R42.1 60.26,13.97 57.23,13.97 56.85,14.35 56.85,18.29 57.61,19.05 58.76,19.05 59.65,19.94 59.65,21.59 Q6.1 ; R42.1 62.93,13.08 62.93,15.22 D7.K
$1N28925: length 11.1
  Top Layer w0.254: Q7.1 62.55,19.11 62.55,21.52 D12.K 64.29,23.26 R47.1 66.91,21.46 R48.2
$1N29096: length 1.7
  Top Layer w0.254: U6.6 75.5,12.96 R50.2
$1N33127: length 11.2
  Top Layer w0.254: v1(69.17,14.48) 69.14,14.51 D10.K ; v1(72.6,16.13) 71.11,16.13 U6.2 70.33,16.12 70.08,16.38 70.08,17.25 D8.K
  Bottom Layer w0.254: v1(72.6,16.13) 70.82,16.13 v1(69.17,14.48)
$1N33138: length 11.9
  Top Layer w0.254: U6.3 72.09,15.62 72.35,15.37 72.35,14.35 70.19,12.19 R42.2
$1N58085: length 2.2
  Top Layer w0.254: R6.2 83.64,49.91 R7.2
$1N61682: length 13.2
  Top Layer w0.254: R47.2 73.16,23.26 76.38,20.04 76.38,16.95 76.05,16.62 U6.10
$1N61689: length 9.7
  Top Layer w0.254: U6.4 70.21,15.12 C34.1 69.11,16.72 67.83,18.01 D10.A 67.08,16.68 R46.2
$1N61740: length 7.4
  Top Layer w0.254: R8.1 84.56,51.41 v1(83.9,51.41) 85.18,50.13 R7.1
  Bottom Layer w0.254: v1(82.1,48.39) 83.9,50.19 v1(83.9,51.41)

## Copper pours and planes (outline as drawn; the poured copper is in the pictures)
GND on Top Layer: -201.47,52.26 -100.88,52.26 -100.88,-10.48 -201.47,-10.48
GND on Top Layer: 92.22,17.53 97.43,17.53 97.43,7.62 92.22,7.62
GNDMCU on Bottom Layer: -439.91,16.64 -332.46,16.64 -332.46,-52.96 -439.91,-52.96
VBAT on Top Layer: 88.16,32.51 97.56,32.51 97.56,19.56 88.16,19.56
VBATO on Top Layer: 50.04,36.58 91.21,36.58 91.21,7.49 50.04,7.49
VCC3V3 on Top Layer: 77.37,55.63 80.82,55.63 80.82,48.39 77.37,48.39
VCC12V on Top Layer: 84.1,44.07 91.46,44.07 91.46,40.77 84.1,40.77
VCC12V on Bottom Layer: 89.68,49.53 93.62,49.53 93.62,40.39 89.68,40.39
LCCA on Bottom Layer: 12.34,36.7 62.25,36.7 62.25,26.14 12.34,26.14
LCCB on Top Layer: 3.83,11.3 20.22,11.3 20.22,6.35 3.83,6.35
LCCB on Bottom Layer: 9.61,10.67 3.71,8 3.58,7.11 4.09,6.6 56.54,7.37 59.2,9.91 59.26,15.24 58.76,15.75 57.74,15.75 57.23,15.24 57.23,12.19 55.95,11.05
$1N5033 on Top Layer: 89.81,54.74 97.81,54.74 97.81,48.39 89.81,48.39
$1N7132 on Top Layer: 87.14,49.15 90.7,49.15 90.7,47.12 87.14,47.12
$1N9081 on Top Layer: 88.8,36.32 94.64,36.32 94.64,30.48 88.8,30.48
$1N24970 on Top Layer: 2.75,22.1 4.98,22.1 4.98,11.94 2.75,11.94
$1N25020 on Top Layer: 5.74,22.1 24.91,22.1 24.91,11.94 5.74,11.94

## Text on the board
Bottom Layer: 浙江工商大学 / 四斤苹果队 / 2023/5/01
